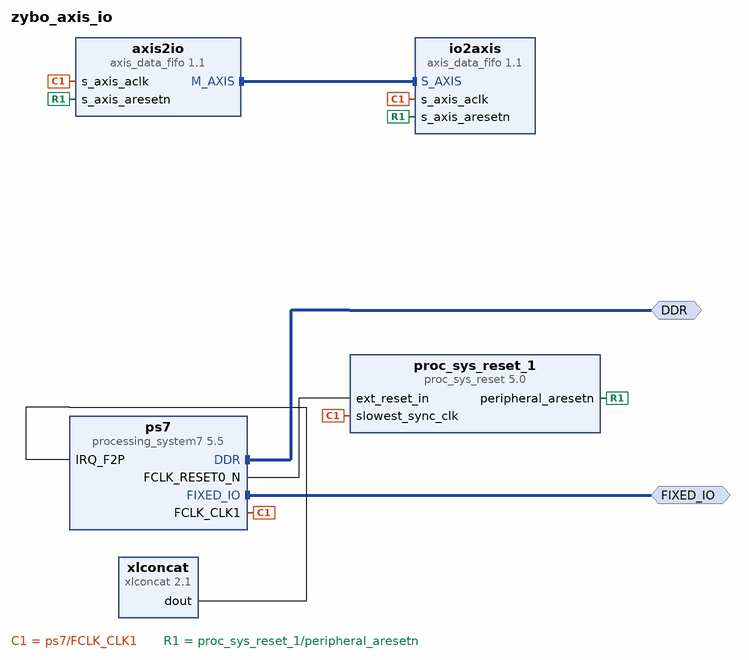
[diagram p0: block diagram of the top level]
# Vivado block design zybo_axis_io, Vivado 2015.2
create_bd_design zybo_axis_io

create_bd_intf_port -mode Master -vlnv xilinx.com:interface:ddrx_rtl:1.0 DDR
create_bd_intf_port -mode Master -vlnv xilinx.com:display_processing_system7:fixedio_rtl:1.0 FIXED_IO

create_bd_cell -type ip -vlnv xilinx.com:ip:axis_data_fifo:1.1 axis2io
set_property -dict {CONFIG.TDATA_NUM_BYTES 4 CONFIG.HAS_TKEEP 1 CONFIG.HAS_TLAST 1} [get_bd_cells axis2io]
create_bd_cell -type ip -vlnv xilinx.com:ip:axis_data_fifo:1.1 io2axis
set_property -dict {CONFIG.TDATA_NUM_BYTES 4 CONFIG.HAS_TKEEP 1 CONFIG.HAS_TLAST 1} [get_bd_cells io2axis]
create_bd_cell -type ip -vlnv xilinx.com:ip:proc_sys_reset:5.0 proc_sys_reset_1
create_bd_cell -type ip -vlnv xilinx.com:ip:processing_system7:5.5 ps7
set_property -dict [list \
  CONFIG.PCW_FPGA0_PERIPHERAL_FREQMHZ 25 \
  CONFIG.PCW_FPGA1_PERIPHERAL_FREQMHZ 100 \
  CONFIG.PCW_FPGA2_PERIPHERAL_FREQMHZ 125 \
  CONFIG.PCW_USE_M_AXI_GP0 0 \
  CONFIG.PCW_USE_FABRIC_INTERRUPT 1 \
  CONFIG.PCW_EN_CLK0_PORT 0 \
  CONFIG.PCW_EN_CLK1_PORT 1 \
  CONFIG.PCW_IRQ_F2P_INTR 1 \
  CONFIG.PCW_IMPORT_BOARD_PRESET ZYBO_zynq_def.xml \
  CONFIG.PCW_QSPI_PERIPHERAL_ENABLE 1 \
  CONFIG.PCW_QSPI_GRP_SINGLE_SS_ENABLE 1 \
  CONFIG.PCW_ENET0_PERIPHERAL_ENABLE 0 \
  CONFIG.PCW_UART1_PERIPHERAL_ENABLE 0 \
  CONFIG.PCW_USB0_PERIPHERAL_ENABLE 0 \
] [get_bd_cells ps7]
# 7 more settings of ps7 are not shown: defaults, MIO pin electricals, DDR timing, and values the tool derives
create_bd_cell -type ip -vlnv xilinx.com:ip:xlconcat:2.1 xlconcat
set_property -dict {CONFIG.NUM_PORTS 1} [get_bd_cells xlconcat]

# ---- connections ----

connect_bd_intf_net [get_bd_intf_pins axis2io/M_AXIS] [get_bd_intf_pins io2axis/S_AXIS]
connect_bd_intf_net [get_bd_intf_ports DDR] [get_bd_intf_pins ps7/DDR]
connect_bd_intf_net [get_bd_intf_ports FIXED_IO] [get_bd_intf_pins ps7/FIXED_IO]
connect_bd_net -net clkid1 [get_bd_pins ps7/FCLK_CLK1] \
  [get_bd_pins axis2io/s_axis_aclk] [get_bd_pins io2axis/s_axis_aclk] [get_bd_pins proc_sys_reset_1/slowest_sync_clk]
connect_bd_net [get_bd_pins proc_sys_reset_1/peripheral_aresetn] [get_bd_pins axis2io/s_axis_aresetn] [get_bd_pins io2axis/s_axis_aresetn]
connect_bd_net [get_bd_pins ps7/FCLK_RESET0_N] [get_bd_pins proc_sys_reset_1/ext_reset_in]
connect_bd_net [get_bd_pins xlconcat/dout] [get_bd_pins ps7/IRQ_F2P]

validate_bd_design
save_bd_design
